# EAGLE design ESP_Breakout (EAGLE 9.2.0)
COMPANY: ADAFRUIT INDUSTRIES; DRAWN: KTOWN; REV: B
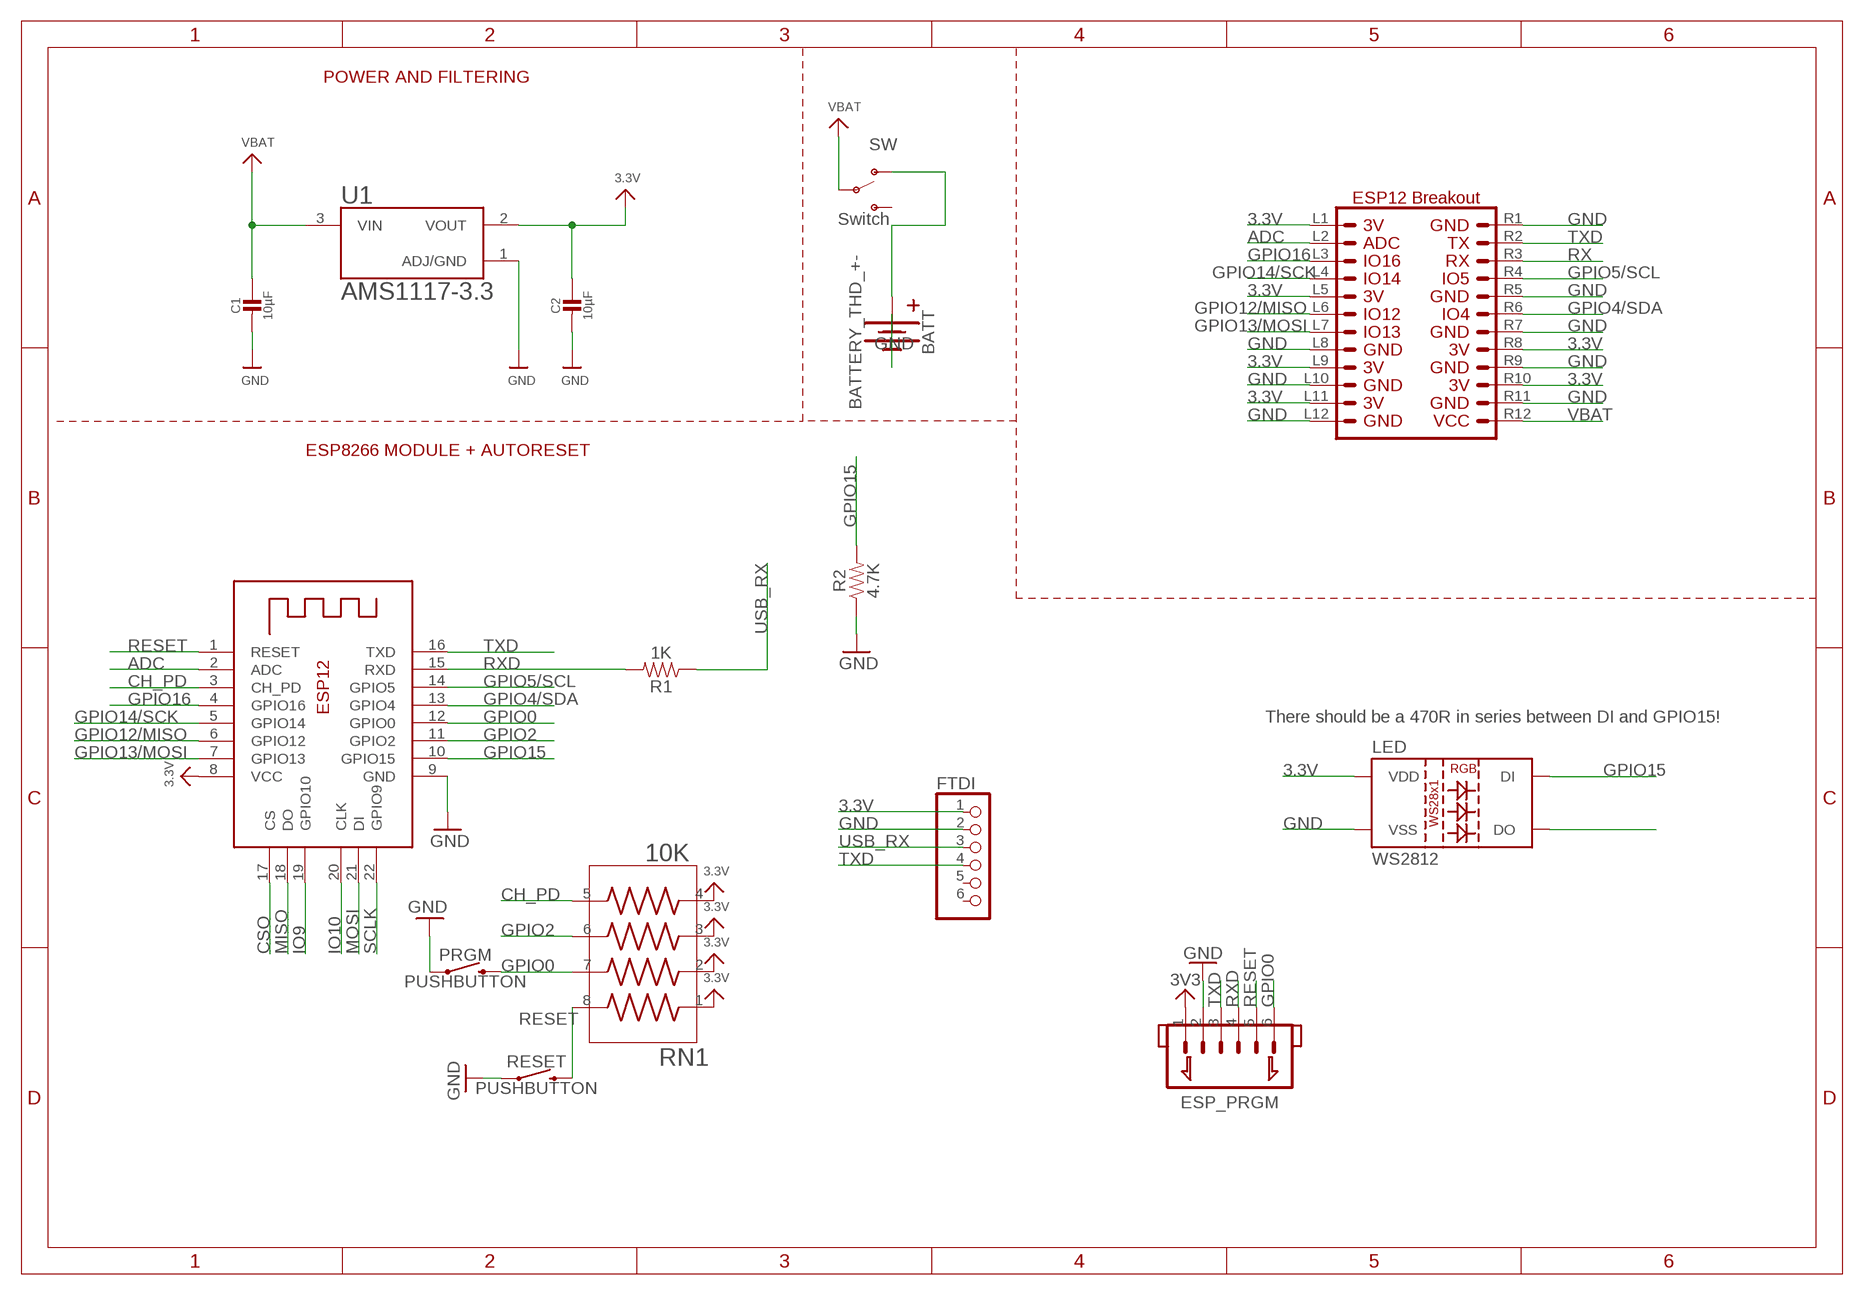
[diagram p0: schematic, sheet 1]

## Parts
BATT  BATTERY_THD_+-  [1X02_PLUS_MINUS]
C1  10µF  CAP_CERAMIC_0603  [CAP_0603]
C2  10µF  CAP_CERAMIC_0603  [CAP_0603]
ESP_PRGM  JST_1.25_6P  [JST1.25_6P]
FTDI  PINHD-1X6  [1X06]
LED  WS2812  [LED-TRICOLOR-5050-IC]
PRGM  PUSHBUTTON  [TACTILE_SWITCH_SMD_6.0X3.5MM]
R1  1K  RESISTOR0603  [0603]
R2  4.7K  RESISTOR0603  [0603]
RESET  PUSHBUTTON  [TACTILE_SWITCH_SMD_6.0X3.5MM]
RN1  10K  RESISTOR_ARRAY_1206  [RESCAF80P320X160X60-8N]
SW  Switch  SWITCH_SPDT_SLIDE  [SWITCH_SPDT_PTH_11.6X4.0MM]
U1  AMS1117-3.3  [SOT229P700X180-4N]
U$7  ESP12_BREAKOUT  [ESP12_BREAKOUT_CONN]
X2  ESP-12  ESP-12E  [ESP-12E]

## Nets
3.3V: C2.1 ESP_PRGM.1 FTDI.1 LED.VDD RN1.1 RN1.2 RN1.3 RN1.4 U1.2(VOUT) U$7.L1 U$7.L5 U$7.L9 U$7.L11 U$7.R8 U$7.R10 X2.8(VCC) ; supply symbol labelled SUPPLY_3.3V
ADC: U$7.L2 X2.2(ADC)
CH_PD: RN1.5 X2.3(CH_PD)
CSO: X2.17(CS)
GND: BATT.- C1.2 C2.2 ESP_PRGM.2 FTDI.2 LED.VSS PRGM.1 R2.1 RESET.1 U1.1(ADJ/GND) U$7.L8 U$7.L10 U$7.L12 U$7.R1 U$7.R5 U$7.R7 U$7.R9 U$7.R11 X2.9(GND) ; supply symbol labelled SUPPLY_GND
GPIO0: ESP_PRGM.6 PRGM.2 RN1.7 X2.12(GPIO0)
GPIO2: RN1.6 X2.11(GPIO2)
GPIO4/SDA: U$7.R6 X2.13(GPIO4)
GPIO5/SCL: U$7.R4 X2.14(GPIO5)
GPIO12/MISO: U$7.L6 X2.6(GPIO12)
GPIO13/MOSI: U$7.L7 X2.7(GPIO13)
GPIO14/SCK: U$7.L4 X2.5(GPIO14)
GPIO15: LED.DIN(DI) R2.2 X2.10(GPIO15)
GPIO16: U$7.L3 X2.4(GPIO16)
IO9: X2.19(GPIO10)
IO10: X2.20(CLK)
MISO: X2.18(DO)
MOSI: X2.21(DI)
N$1: BATT.+ SW.1(O)
N$5: LED.DOUT(DO)
RESET: ESP_PRGM.5 RESET.2 RN1.8 X2.1(RESET)
RX: U$7.R3
RXD: ESP_PRGM.4 R1.2 X2.15(RXD)
SCLK: X2.22(GPIO9)
TXD: ESP_PRGM.3 FTDI.4 U$7.R2 X2.16(TXD)
USB_RX: FTDI.3 R1.1
VBAT: C1.1 SW.2(P) U1.3(VIN) U$7.R12
Unconnected: FTDI.5 FTDI.6 SW.3(S)

## Notes on the sheet
- POWER AND FILTERING
- ESP8266 MODULE + AUTORESET
- There should be a 470R in series between DI and GPIO15!

## Library data of the parts
BATT = AutoPark:BATTERY_THD_+-
C1 C2 = Scott-Electrical:CAP_CERAMIC
ESP_PRGM = Scott-Connectors:JST_1.25_6P
FTDI = pinhead:PINHD-1X6: PIN HEADER
LED = AutoPark:WS2812
PRGM RESET = AutoPark:PUSHBUTTON
R1 R2 = Scott-Electrical:RESISTOR: Generic Resistor Package
RN1 = AutoPark:RESISTOR_ARRAY_1206: Res Thick Film Array 75 Ohm 5% 0.25W(1/4W) ?200ppm/C ISOL Molded 8-Pin 1206(4 X 0603) Convex SMD T/R; AVAILABILITY: Unavailable; DESCRIPTION: Res Thick Film Array 75 Ohm 5% 0.25W_1/4W_ ?200ppm/C ISOL Molded 8-Pin 1206_4 X 0603_ Convex SMD T/R; MF: Bourns; MP: CAY16-750J4LF; PACKAGE: 1206 Bourns; PRICE: None
SW = AutoPark:SWITCH_SPDT_SLIDE: 拨动开关SK12D07VG2/3/4/5/6 侧面5脚拨动带支架 3脚2档柄高6MM Taobao <https://item.taobao.com/item.htm?spm=a1z09.2.0.0.53a62e8d0RVocC&id=563254128682&_u=s1po4ce26496> Dimensional Drawing <https://img.alicdn.com/imgextra/i1/2744920356/TB2568GkMDD8KJjy0FdXXcjvXXa_!!2744920356.jpg>
U1 = AutoPark:AMS1117-3.3: Sot223/Pkg 1-Amp 3.3-Volt Low Drop Out Voltage Regulatator; AVAILABILITY: Unavailable; DESCRIPTION: Sot223/Pkg 1-Amp 3.3-Volt Low Drop Out Voltage Regulatator; MF: Advanced Monolithic Systems; MP: AMS1117-3.3; PACKAGE: None; PRICE: None
U$7 = AutoPark:ESP12_BREAKOUT
X2 = microbuilder:ESP-12E

## Net classes
1 power: width 0.178 mm

## Board
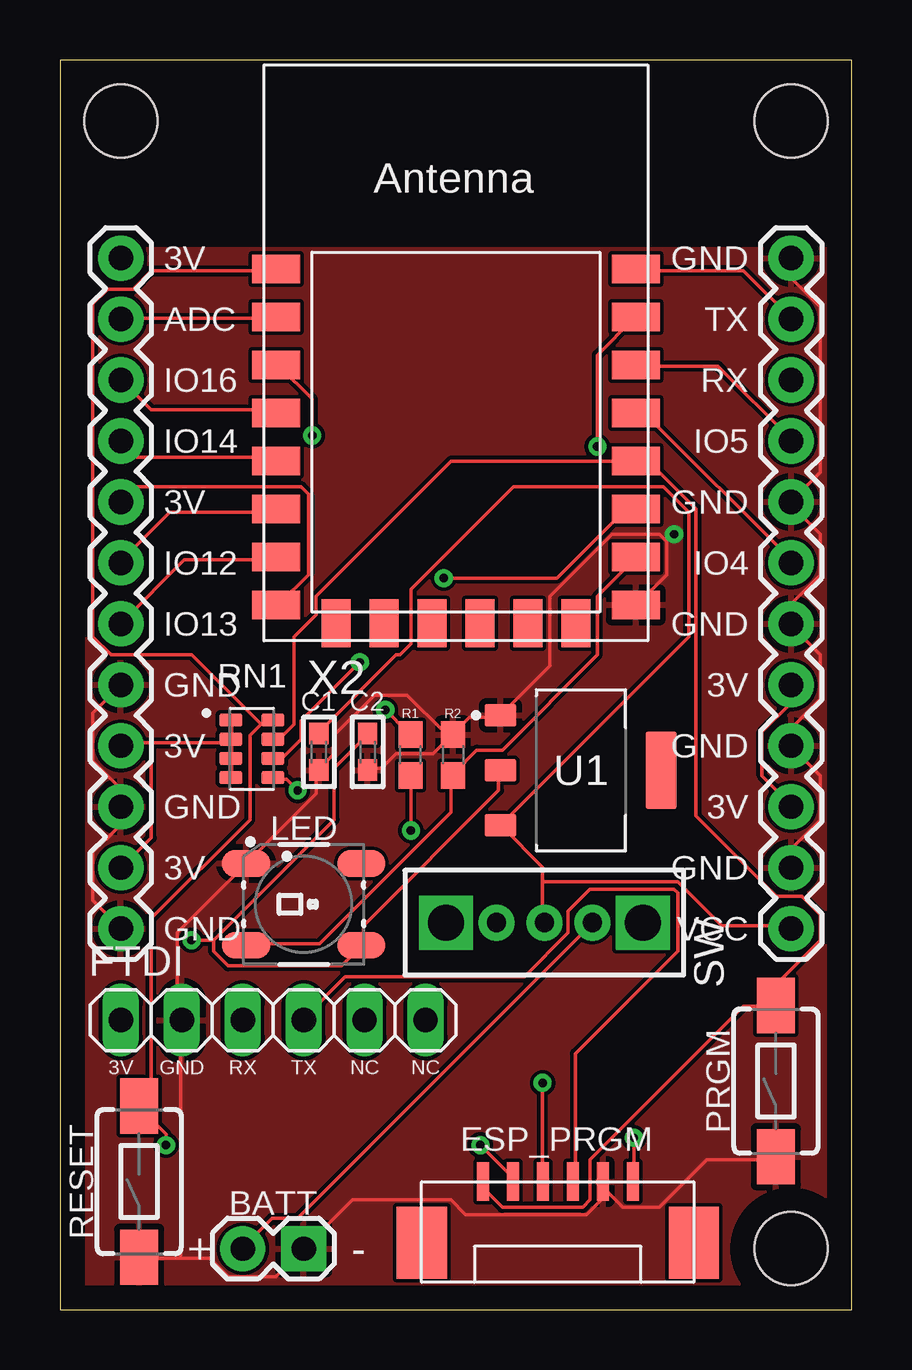
[diagram p1: board, top side]
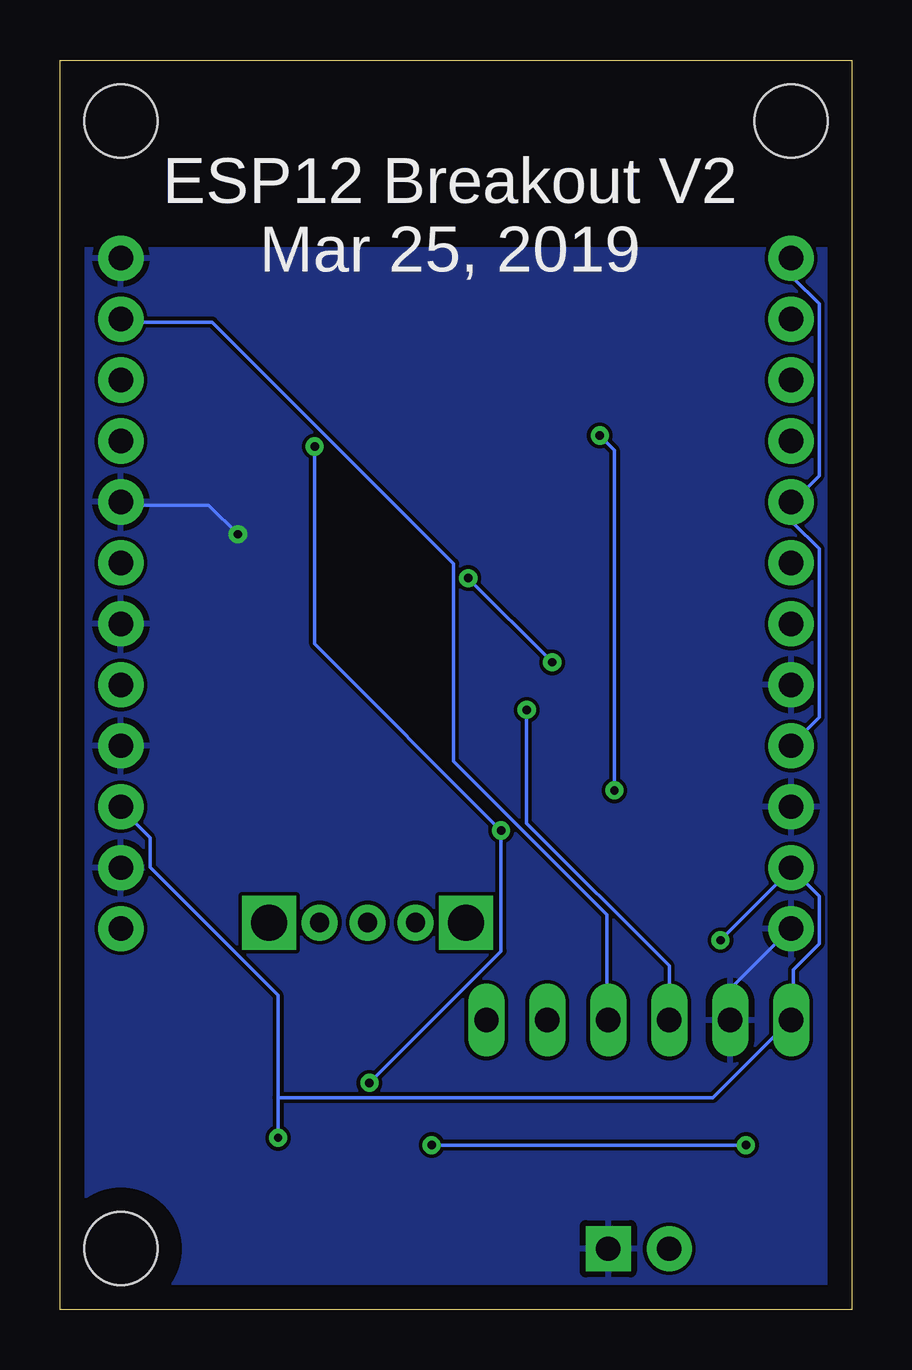
[diagram p2: board, bottom side, seen from below]

Size 33.02 x 52.07 mm. Coordinates in mm from the lower left corner, seen from the top.
Outline: 0,0 33.02,0 33.02,52.07 0,52.07 0,0
Copper layers (1*16): Top 0.035mm / dielectric 1.5mm / Bottom 0.035mm
Design rules "default *": minimum track width 6mil, minimum drill 0.35mm, track to track 6mil, track to pad 6mil, pad to pad 6mil, via to via 6mil, smd to smd 6mil, copper to edge 40mil, drill to drill 6mil, minimum pad ring 10mil, minimum via ring 8mil, stop-mask expansion 4mil, vias tented up to drill 15mil, thermal gap 10mil
Holes 3.05 mm at 30.48,2.54 30.48,49.53 2.54,49.53

### Footprints (pad centres in the part's own frame; a part is rotated, then mirrored left to right if it is on the bottom)
1X02_PLUS_MINUS = drill 1.016 pad 1.88: + 0,0 | drill 1.016 pad 1.88 square: - 2.54,0
CAP_0603 = smd 0.9 x 0.8: 1 -0.762,0; 2 0.762,0
JST1.25_6P = smd 0.5 x 1.6: 1 0,0; 2 1.25,0; 3 2.5,0; 4 3.75,0; 5 5,0; 6 6.25,0 | smd 2.1 x 3: 7 -2.55,2.55; 8 8.8,2.55
1X06 = drill 1.016 long: 1 -6.35,0; 2 -3.81,0; 3 -1.27,0; 4 1.27,0; 5 3.81,0; 6 6.35,0
LED-TRICOLOR-5050-IC = smd 2 x 1.1: DIN -2.4,-1.7; DOUT 2.4,1.7; VDD 2.4,-1.7; VSS -2.4,1.7
TACTILE_SWITCH_SMD_6.0X3.5MM = smd 2.3 x 1.6: 1 -3.15,0; 2 3.15,0
0603 = smd 1.1 x 1: 1 -0.85,0; 2 0.85,0
RESCAF80P320X160X60-8N = smd 0.97 x 0.53: 1 -0.875,1.2; 2 -0.875,0.4; 3 -0.875,-0.4; 4 -0.875,-1.2; 5 0.875,-1.2; 6 0.875,-0.4; 7 0.875,0.4; 8 0.875,1.2
SWITCH_SPDT_PTH_11.6X4.0MM = drill 0.8 pad 1.5: 1 0,2; 2 0,0; 3 0,-2 | drill 1.5 pad 1.8 square: P$1 0,-4.1; P$2 0,4.1
SOT229P700X180-4N = smd 0.93 x 1.31: 1 -2.29,-3.345; 2 0,-3.345; 3 2.29,-3.345 | smd 3.24 x 1.31: 4 0,3.345
ESP12_BREAKOUT_CONN = drill 1.016 pad 1.88: L1 1.27,29.21; L2 1.27,26.67; L3 1.27,24.13; L4 1.27,21.59; L5 1.27,19.05; L6 1.27,16.51; L7 1.27,13.97; L8 1.27,11.43; L9 1.27,8.89; L10 1.27,6.35; L11 1.27,3.81; L12 1.27,1.27; R1 29.21,29.21; R2 29.21,26.67; R3 29.21,24.13; R4 29.21,21.59; R5 29.21,19.05; R6 29.21,16.51; R7 29.21,13.97; R8 29.21,11.43; R9 29.21,8.89; R10 29.21,6.35; R11 29.21,3.81; R12 29.21,1.27
ESP-12E = smd 2 x 1.2: 1 -7.5,5.77; 2 -7.5,3.77; 3 -7.5,1.77; 4 -7.5,-0.23; 5 -7.5,-2.23; 6 -7.5,-4.23; 7 -7.5,-6.23; 8 -7.5,-8.23; 9 7.5,-8.23; 10 7.5,-6.23; 11 7.5,-4.23; 12 7.5,-2.23; 13 7.5,-0.23; 14 7.5,1.77; 15 7.5,3.77; 16 7.5,5.77 | smd 1.2 x 2: 17 -5,-9; 18 -3,-9; 19 -1,-9; 20 1,-9; 21 3,-9; 22 5,-9

### Placement (x,y rotation side)
BATT  7.62,2.54 0 top
C1  10.79,23.24 270 top
C2  12.83,23.24 270 top
ESP_PRGM  23.88,5.33 180 top
FTDI  8.89,12.06 0 top
LED  10.16,16.89 0 top
PRGM  29.84,9.53 90 top
R1  14.61,23.11 270 top
R2  16.38,23.11 270 top
RESET  3.3,5.33 90 top
RN1  8,23.37 0 top
SW  20.19,16.13 270 top
U1  21.72,22.48 270 top
U$7  1.27,14.61 0 top
X2  16.51,37.59 0 top

### Tracks (layer width: path | path; a pad name or v marks a point on that pad's centre or on a via)
3.3V  (via drill 0.35)
  Top 0.152: v23.93,7.16 23.93,5.33 ESP_PRGM.1 | U$7.R8 30.48,25.3 29.26,24.08 29.26,22.25 30.48,21.03 U$7.R10 | X2.8 9.14,29.41 10.36,30.63 10.36,33.98 10.06,34.29 3.2,34.29 2.59,33.68 U$7.L5 | 6.4,15.39 11.43,20.42 11.43,22.55 12.8,23.93 C2.1 | 6.4,15.39 6.4,14.94 7.01,14.33 11.73,14.33 12.5,15.09 LED.VDD 12.65,15.24 12.65,16 18.29,21.64 18.29,22.4 U1.2 | RN1.4 7.16,22.25 7.16,22.86 RN1.3 7.16,23.01 7.16,23.62 RN1.2 | RN1.1 7.16,24.54 7.16,23.77 RN1.2 | 3.81,23.62 2.59,23.62 U$7.L9 | 3.81,23.62 7.01,23.62 RN1.2 | 3.81,23.62 3.81,19.66 2.59,18.44 U$7.L11 | v5.49,15.39 6.4,15.39
  Bottom 0.152: 23.93,8.84 23.93,13.11 29.26,18.44 29.26,19.66 30.48,20.88 U$7.R10 | 23.93,8.84 v23.93,7.16 | U$7.L1 2.44,43.74 2.44,42.98 1.37,41.91 1.37,34.75 2.44,33.68 U$7.L5 2.44,33.53 2.44,32.77 1.37,31.7 1.37,24.69 2.44,23.62 U$7.L9 | v5.49,15.39 2.59,18.29 U$7.L11 2.44,18.29 1.37,17.22 1.37,15.24 2.44,14.17 2.44,12.19 FTDI.1 2.59,12.04 5.79,8.84 23.93,8.84
ADC
  Top 0.152: X2.2 8.99,41.3 2.59,41.3 U$7.L2
CH_PD  (via drill 0.35)
  Top 0.152: v9.91,21.64 9.45,22.1 8.99,22.1 RN1.5 | v10.52,36.42 10.52,37.95 9.14,39.32 X2.3
  Bottom 0.152: v9.91,21.64 9.91,35.81 v10.52,36.42
GND  (via drill 0.35)
  Top 0.152: 22.86,4.88 23.47,4.27 24.99,4.27 26.98,6.25 29.72,6.25 PRGM.1 | 22.86,4.88 22.71,5.03 22.71,5.33 ESP_PRGM.2 22.86,4.88 | 5.03,2.13 6.25,2.13 7.01,1.37 8.99,1.37 BATT.- 12.19,4.57 16.31,4.57 16.92,3.96 21.95,3.96 22.86,4.88 | 5.03,2.13 3.35,2.13 RESET.1 | U$7.R11 30.48,19.2 31.7,20.42 31.7,22.25 30.48,23.47 U$7.R9 30.48,24.23 31.7,25.45 31.7,27.28 30.48,28.5 U$7.R7 30.48,29.41 31.7,30.63 31.7,32.31 30.48,33.53 U$7.R5 30.48,33.68 31.7,34.9 31.7,41.76 30.48,42.98 U$7.R1 | C2.2 12.95,22.55 13.41,22.55 14.02,23.16 15.54,23.16 16.31,23.93 R2.1 | R2.1 16.46,24.08 17.07,24.69 18.29,24.69 U1.1 18.44,24.84 20.42,26.82 20.42,29.72 23.01,32.31 24.99,32.31 25.3,32 | 25.3,32 25.3,30.63 24.08,29.41 X2.9 | U$7.L8 2.44,25.91 1.37,24.84 1.37,22.86 2.44,21.79 2.44,21.03 U$7.L10 2.44,20.88 2.44,20.12 1.37,19.05 1.37,17.07 2.44,16 U$7.L12 | R2.1 16.31,24.08 16,24.08 14.48,25.6 13.11,25.6 11.43,23.93 11.43,23.16 10.82,22.55 C1.2 10.67,22.4 10.67,21.49 7.77,18.59 LED.VSS 7.62,18.44 4.88,15.7 4.88,12.34 5.03,12.19 FTDI.2 5.03,12.04 5.03,2.13 | 25.3,32 v25.6,32.31
  Bottom 0.152: FTDI.2 5.03,12.19 5.03,13.41 2.59,15.85 U$7.L12 | v25.6,32.31 26.82,33.53 30.48,33.53 U$7.R5
  pour Top: 0,44.2 33.02,44.2 33.02,43.94 33.02,0 0,0
  pour Bottom: 0,44.2 33.02,44.2 33.02,0 0,0
GPIO0
  Top 0.152: ESP_PRGM.6 17.68,5.33 17.68,5.03 18.44,4.27 21.79,4.27 22.1,4.57 22.1,6.25 28.5,12.65 29.72,12.65 PRGM.2 29.87,12.8 29.87,13.56 31.7,15.39 31.7,16.46 30.94,17.22 29.87,17.22 26.52,20.57 26.52,33.38 24.54,35.36 24.08,35.36 X2.12 23.93,35.36 16.31,35.36 10.67,29.72 10.67,28.96 9.75,28.04 9.75,24.38 9.14,23.77 8.99,23.77 RN1.7
GPIO2  (via drill 0.35)
  Top 0.152: v12.5,26.98 10.06,24.54 10.06,23.77 9.3,23.01 8.99,23.01 RN1.6 | v16,30.48 20.73,30.48 23.47,33.22 23.93,33.22 X2.11
  Bottom 0.152: v16,30.48 v12.5,26.98
GPIO4/SDA
  Top 0.152: X2.13 24.08,37.34 24.38,37.34 30.48,31.24 U$7.R6
GPIO5/SCL
  Top 0.152: X2.14 24.08,39.32 27.43,39.32 30.48,36.27 U$7.R4
GPIO12/MISO
  Top 0.152: X2.6 8.99,33.22 4.57,33.22 2.59,31.24 U$7.L6
GPIO13/MOSI
  Top 0.152: X2.7 8.99,31.24 5.18,31.24 2.59,28.65 U$7.L7
GPIO14/SCK
  Top 0.152: X2.5 8.99,35.51 3.2,35.51 2.59,36.12 U$7.L4
GPIO15
  Top 0.152: LED.DIN 7.77,15.24 10.82,15.24 16.31,20.73 16.31,22.25 R2.2 16.46,22.4 17.37,23.32 18.44,23.32 22.4,27.28 22.4,29.72 23.93,31.24 X2.10
GPIO16
  Top 0.152: X2.4 8.99,37.49 3.81,37.49 2.59,38.71 U$7.L3
N$1
  Top 0.152: SW.1 22.1,16 9.91,3.81 8.84,3.81 7.62,2.59 BATT.+
RESET  (via drill 0.35)
  Top 0.152: 8.38,24.38 7.92,23.93 7.92,20.42 3.81,16.31 3.81,8.99 3.35,8.53 RESET.2 3.35,8.38 4.42,7.32 v4.42,6.86 | 8.38,24.38 8.53,24.54 8.84,24.54 RN1.8 | v17.53,6.86 18.75,5.64 18.75,5.33 ESP_PRGM.5 | 8.38,24.38 5.49,27.28 2.13,27.28 1.37,28.04 1.37,41.91 1.98,42.52 3.05,42.52 3.81,43.28 8.99,43.28 X2.1
  Bottom 0.152: v4.42,6.86 v17.53,6.86
RXD  (via drill 0.35)
  Top 0.152: v14.63,19.96 14.63,22.25 R1.2 | v20.12,9.45 20.12,5.33 ESP_PRGM.4 | v22.4,35.97 22.4,39.78 23.93,41.3 X2.15
  Bottom 0.152: v20.12,9.45 14.63,14.94 v14.63,19.96 22.4,27.74 v22.4,35.97
TXD
  Top 0.152: X2.16 24.08,43.28 28.5,43.28 30.48,41.3 U$7.R2 | ESP_PRGM.3 21.49,5.33 21.49,10.67 25.76,14.94 25.76,17.37 25.6,17.53 22.1,17.53 21.18,16.61 21.18,15.7 19.36,13.87 11.89,13.87 10.21,12.19 FTDI.4
  Bottom 0.152: U$7.R2 30.48,41.15 26.67,41.15 16.61,31.09 16.61,22.86 10.21,16.46 10.21,12.19 FTDI.4
USB_RX  (via drill 0.35)
  Top 0.152: v13.56,24.99 14.48,24.08 R1.1
  Bottom 0.152: v13.56,24.99 13.56,20.27 7.62,14.33 FTDI.3
VBAT
  Top 0.152: C1.1 10.82,24.08 14.02,27.28 14.17,27.28 14.63,27.74 14.63,30.02 18.9,34.29 25.15,34.29 26.21,33.22 26.21,28.04 18.44,20.27 U1.3 18.44,20.12 20.12,18.44 20.12,17.83 | 20.12,17.83 20.12,16.15 SW.2 | 20.12,17.83 25.76,17.83 27.58,16 30.48,16 U$7.R12

### Text on the board
tPlace: 3V | GND | RX | TX | NC | NC
bPlace: ESP12 Breakout V2 / Mar 25, 2019